# Altium schematic sheet ethernet.SchDoc
size 431 x 279 mm
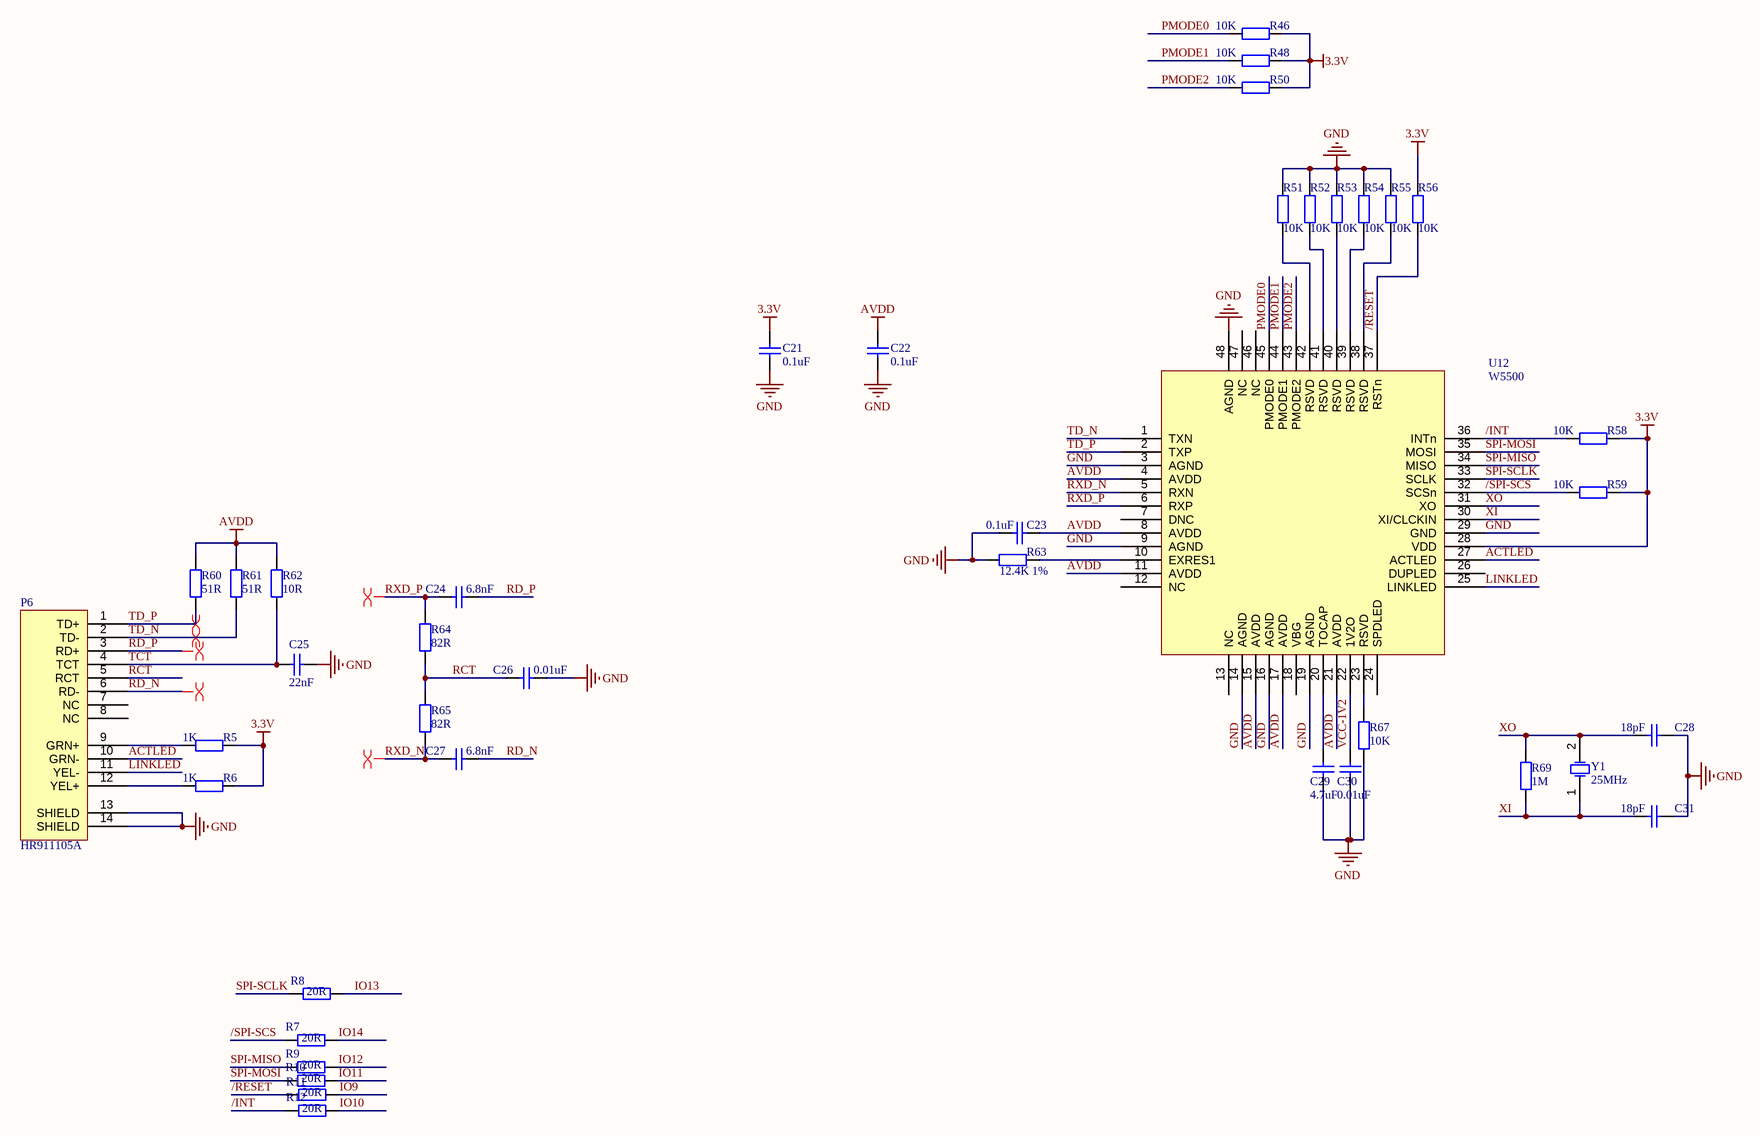
[diagram p0: ethernet.SchDoc]

## Parts
C21  value 0.1uF  [C0805]  (hidden comment: Cap)
C22  value 0.1uF  [C0805]  (hidden comment: Cap)
C23  value 0.1uF  [C0805]  (hidden comment: Cap)
C24  value 6.8nF  [C0805]  (hidden comment: Cap)
C25  value 22nF  [C0805]  (hidden comment: Cap)
C26  value 0.01uF  [C0805]  (hidden comment: Cap)
C27  value 6.8nF  [C0805]  (hidden comment: Cap)
C28  value 18pF  [C0805]  (hidden comment: Cap)
C29  value 4.7uF  [C0805]  (hidden comment: Cap)
C30  value 0.01uF  [C0805]  (hidden comment: Cap)
C31  value 18pF  [C0805]  (hidden comment: Cap)
P6  HR911105A  [HR911105A]
R5  value 1K  [C0805]  (hidden comment: Res2)
R6  value 1K  [C0805]  (hidden comment: Res2)
R7  value 20R  [C0805]  (hidden comment: Res2)
R8  value 20R  [C0805]  (hidden comment: Res2)
R9  value 20R  [C0805]  (hidden comment: Res2)
R10  value 20R  [C0805]  (hidden comment: Res2)
R11  value 20R  [C0805]  (hidden comment: Res2)
R12  value 20R  [C0805]  (hidden comment: Res2)
R46  value 10K  [C0805]  (hidden comment: Res2)
R48  value 10K  [C0805]  (hidden comment: Res2)
R50  value 10K  [C0805]  (hidden comment: Res2)
R51  value 10K  [C0805]  (hidden comment: Res2)
R52  value 10K  [C0805]  (hidden comment: Res2)
R53  value 10K  [C0805]  (hidden comment: Res2)
R54  value 10K  [C0805]  (hidden comment: Res2)
R55  value 10K  [C0805]  (hidden comment: Res2)
R56  value 10K  [C0805]  (hidden comment: Res2)
R58  value 10K  [C0805]  (hidden comment: Res2)
R59  value 10K  [C0805]  (hidden comment: Res2)
R60  value 51R  [C0805]  (hidden comment: Res2)
R61  value 51R  [C0805]  (hidden comment: Res2)
R62  value 10R  [C0805]  (hidden comment: Res2)
R63  value 12.4K 1%  [C0805]  (hidden comment: Res2)
R64  value 82R  [C0805]  (hidden comment: Res2)
R65  value 82R  [C0805]  (hidden comment: Res2)
R67  value 10K  [C0805]  (hidden comment: Res2)
R69  value 1M  [C0805]  (hidden comment: Res2)
U12  W5500  [LQFP48]
Y1  25MHz  [XTAL-HC49]

## Nets
3.3V: C21.1 R5.1 R6.1 R46.2 R48.2 R50.2 R56.2 R58.2 R59.2 U12.28(VDD)
AVDD: C22.2 C23.1 R60.1 R61.1 R62.1 U12.4(AVDD) U12.8(AVDD) U12.11(AVDD) U12.15(AVDD) U12.17(AVDD) U12.21(AVDD)
GND: C21.2 C22.1 C23.2 C25.2 C26.1 C28.1 C29.2 C30.2 C31.1 P6.13(SHIELD) P6.14(SHIELD) R51.2 R52.2 R53.2 R54.2 R55.2 R63.1 R67.1 U12.3(AGND) U12.9(AGND) U12.14(AGND) U12.16(AGND) U12.19(AGND) U12.29(GND) U12.48(AGND)
/INT: R12.2 R58.1 U12.36(INTn)
/RESET: R11.2 R56.1 U12.37(RSTn)
/SPI-SCS: R7.2 R59.1 U12.32(SCSn)
ACTLED: P6.10(GRN-) U12.27(ACTLED)
IO9: R11.1
IO10: R12.1
IO11: R10.1
IO12: R9.1
IO13: R8.1
IO14: R7.1
LINKLED: P6.11(YEL-) U12.25(LINKLED)
PMODE0: R46.1 U12.45(PMODE0)
PMODE1: R48.1 U12.44(PMODE1)
PMODE2: R50.1 U12.43(PMODE2)
RCT: C26.2 P6.5(RCT) R64.1 R65.2
RD_N: C27.1 P6.6(RD-)
RD_P: C24.1 P6.3(RD+)
RXD_N: C27.2 R65.1 U12.5(RXN)
RXD_P: C24.2 R64.2 U12.6(RXP)
SPI-MISO: R9.2 U12.34(MISO)
SPI-MOSI: R10.2 U12.35(MOSI)
SPI-SCLK: R8.2 U12.33(SCLK)
TCT: C25.1 P6.4(TCT) R62.2
TD_N: P6.2(TD-) R61.2 U12.1(TXN)
TD_P: P6.1(TD+) R60.2 U12.2(TXP)
VCC-1V2: C30.1 U12.22(1V2O)
XI: C31.2 R69.1 U12.30(XI/CLCKIN) Y1.1(OSC1)
XO: C28.2 R69.2 U12.31(XO) Y1.2(OSC2)
NetC29_1: C29.1 U12.20(TOCAP)
NetP6_9: P6.9(GRN+) R5.2
NetP6_12: P6.12(YEL+) R6.2
NetR51_1: R51.1 U12.42(RSVD)
NetR52_1: R52.1 U12.41(RSVD)
NetR53_1: R53.1 U12.40(RSVD)
NetR54_1: R54.1 U12.39(RSVD)
NetR55_1: R55.1 U12.38(RSVD)
NetR63_2: R63.2 U12.10(EXRES1)
NetR67_2: R67.2 U12.23(RSVD)

Not connected (* = marked no-connect by the designer): P6 7(NC) 8(NC); U12 7(DNC) 12(NC) 13(NC) 18(VBG) 24(SPDLED) 26(DUPLED) 46(NC) 47(NC)

## Layout directives
differential pair: RD_N, RD_P, RXD_N, RXD_P, TD_N, TD_P

## Notes on the sheet
- DWG. NO.
- REV.
- SHT.
- THIS DOCUMENT AND THE DATA DISCLOSED HEREIN OR HEREWITH IS THE PROPERTY OF ALTIUM LIMITED AND MAY BE FREELY DISTRIBUTED IN WHOLE. NO RIGHTS ARE RESERVED OR EXPRESS OR IMPLIED WARANTEE GIVEN.
- REVISION
- DESCRIPTION
- DATE
- APPROVED
- ENG:
- APPROVALS
- PROJECT
- DSN:
- CHK:
- REFERENCE DOCUMENTS
- PROJECT REVISION:
- TITLE
- DOCUMENT REVISION:
- DESIGN ITEM:
- BOM:
- FAB DWG:
- PCB DWG:
- ASSY DWG:
- SCALE:
- SIZE
- B
- CAGE CODE
- FILE NAME
- DWG NO.
- SHEET
- OF
- REV

## Library data of the parts
C21-C31 = Cap: Capacitor; Published: 8-Jun-2000; LatestRevisionDate: 17-Jul-2002; LatestRevisionNote: Re-released for DXP Platform.; PackageReference: RAD-0.3; Publisher: Altium Limited; PackageDescription: Radial Cap, Thru-Hole; 2 Leads; 0.3 in Pin Spacing
P6 = HR911105A: RJ45插座
R5-R12 R46 R48 R50-R56 R58-R65 R67 R69 = Res2: Resistor; Published: 8-Jun-2000; LatestRevisionDate: 17-Jul-2002; LatestRevisionNote: Re-released for DXP Platform.; PackageReference: AXIAL-0.4; Publisher: Altium Limited; PackageDescription: Axial Device, Thru-Hole; 2 Leads; 0.4 in Pin Spacing
U12 = W5500: W5500以太网芯片
Y1 = XTAL: Crystal Oscillator; Published: 8-Jun-2000; LatestRevisionDate: 17-Jul-2002; LatestRevisionNote: Re-released for DXP Platform.; PackageReference: R38; Publisher: Altium Limited; PackageDescription: Crystal, Thru-Hole; 2 Leads; Body 3.1 x 8.2 mm (Dia.xH)